# Altium schematic sheet CON_SD_KSDC012551.SchDoc: SD-CARD
size A4; Organization: Altium Limited.; DocumentNumber: 52; SheetNumber: 53; SheetTotal: 77; PageSetup: Record=PageOptions|CenterHorizontal=True|CenterVertical=True|PrintScale=0.97|XCorrection=1.00|YCorrection=1.00|PrintKind=0|BorderSize=5000000|LeftOffset=0|BottomOffset=0|Orientation=2|PaperLength=1000|PaperWidth=1000|Scale=100|PaperSource=7|PrintQuality=-4|MediaType=1|DitherType=10|PaperKind=A4 (210 x 297mm)|PrintScaleMode=1
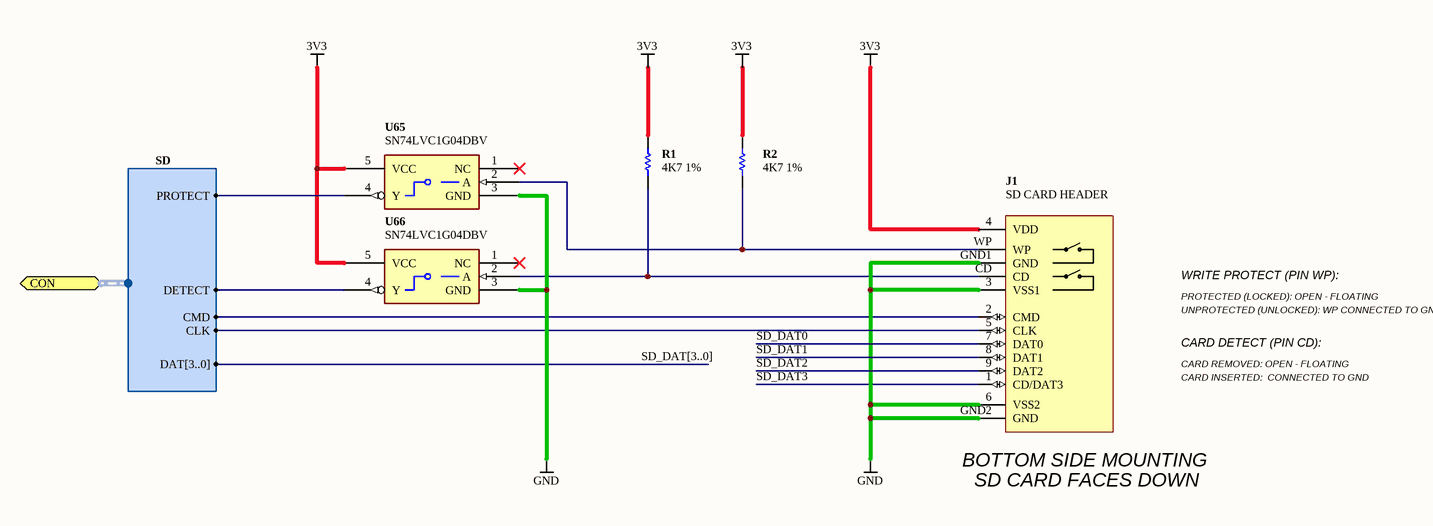
[diagram p0: CON_SD_KSDC012551.SchDoc]

## Parts
J1  SD CARD HEADER  [KSDC012551]
R1  4K7 1%  [RESC1005-STAR]
R2  4K7 1%  [RESC1005-STAR]
U65  SN74LVC1G04DBV  [SOT95P280-5]
U66  SN74LVC1G04DBV  [SOT95P280-5]

## Ports
CON (harness SD)

## Harnesses
SD: DAT[3..0], CMD, CLK, DETECT, PROTECT

## Nets
3V3: J1.4(VDD) R1.1 R2.1 U65.5(VCC) U66.5(VCC)
GND: J1.3(VSS1) J1.6(VSS2) J1.GND1(GND) J1.GND2(GND) U65.3(GND) U66.3(GND)
SD_DAT0: J1.7(DAT0)
SD_DAT1: J1.8(DAT1)
SD_DAT2: J1.9(DAT2)
SD_DAT3: J1.1(CD/DAT3)
NetJ1_2: J1.2(CMD) ; port CON.CMD
NetJ1_5: J1.5(CLK) ; port CON.CLK
NetJ1_CD: J1.CD R1.2 U66.2(A)
NetJ1_WP: J1.WP R2.2 U65.2(A)
NetU65_4: U65.4(Y) ; port CON.PROTECT
NetU66_4: U66.4(Y) ; port CON.DETECT

Not connected (* = marked no-connect by the designer): U65 1(NC)*; U66 1(NC)*

## Buses and harness runs
bus SD_DAT[3..0]

## Notes on the sheet
- WRITE PROTECT (PIN WP):
- PROTECTED (LOCKED): OPEN - FLOATING
- UNPROTECTED (UNLOCKED): WP CONNECTED TO GND
- CARD DETECT (PIN CD):
- CARD REMOVED: OPEN - FLOATING
- CARD INSERTED:  CONNECTED TO GND
- (near J1) BOTTOM SIDE MOUNTING
- (near J1) SD CARD FACES DOWN
- Sheet Title
- Project Title
- Size:
- Date:
- A4
- Assy:
- Time:
- Revision:
- Sheet
- of
- File:

## Library data of the parts
J1 = D-300-0126: Secure Digital Card Socket; Max Current: mA; Connector type: Header; Mounting Technology: Surface Mount; Status: Production; Category: Connector
R1 R2 = D-100-0088: Resistor, 4K7 1% 0402 (1005); Power Rating: 63 mW; Resistance: 4.7 K; Category: Resistor; Mounting Technology: Surface Mount; Status: Production; Tolerance: 1 %
U65 U66 = D-205-0001: SN74LVC1G04DBV, Single Inverter Gate, 1.65-V to 5.5-V; Mounting Technology: Surface Mount; Status: Production; Category: IC-Logic